# Altium schematic sheet ESP_Grow_Main_V2_1_CPU.SchDoc: CPU
size A; DocumentNumber: 3/7/2021; Revision: A; SheetNumber: 5; SheetTotal: 1
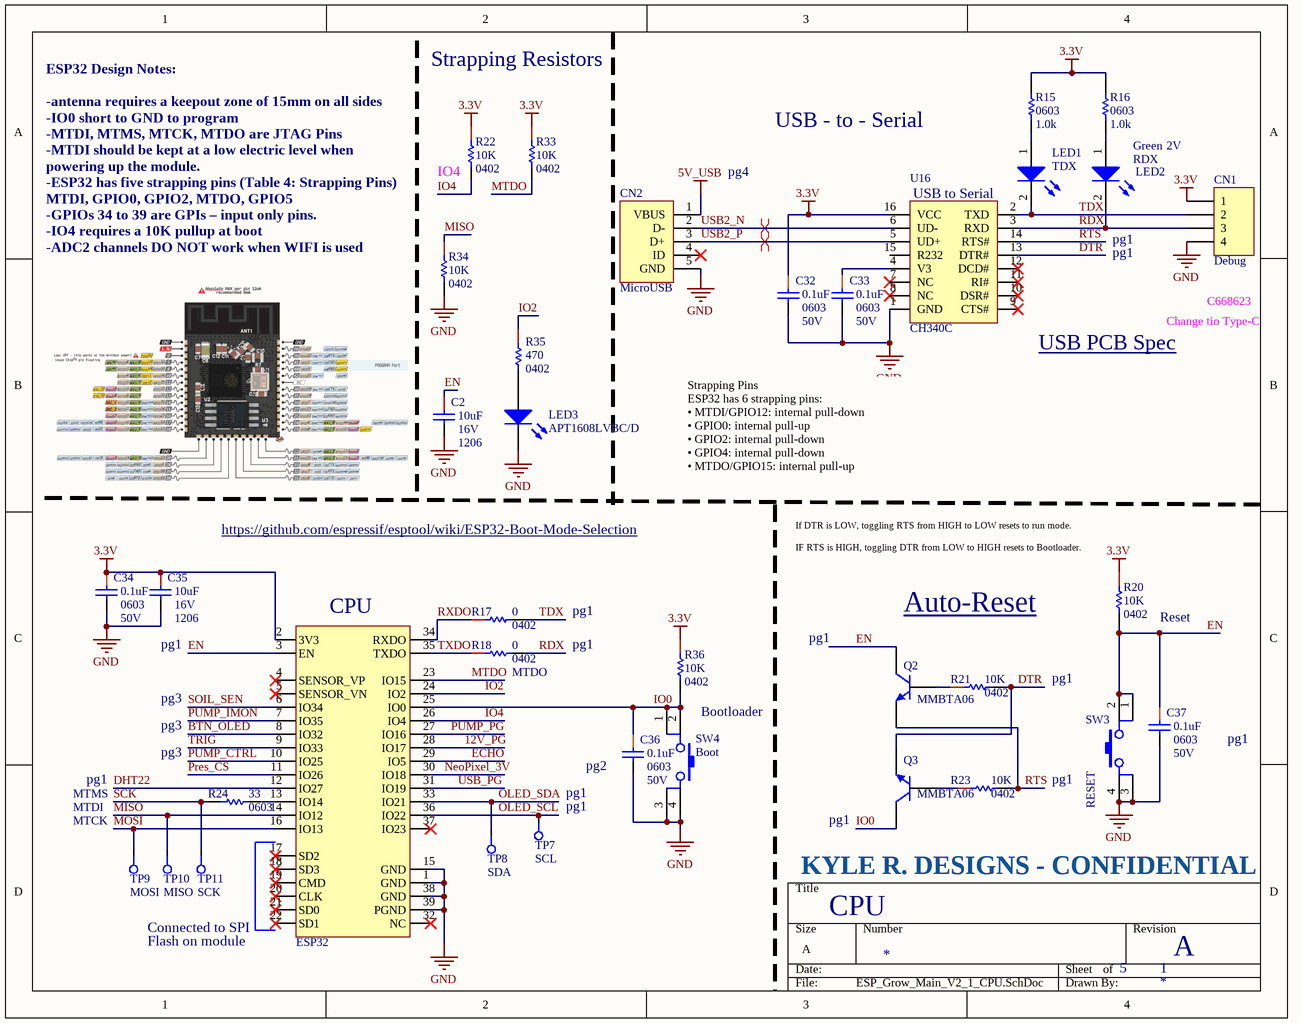
[diagram p0: ESP_Grow_Main_V2_1_CPU.SchDoc]

## Parts
C2  10uF  Voltage - Rated: 16V  Package: 1206  [CAPC1206(3216)_M]
C32  Package / Case: 0603  Voltage - Rated: 50V  [CAPC0603(1608)_L]  (hidden comment: 0.1uF)
C33  Package / Case: 0603  Voltage - Rated: 50V  [CAPC0603(1608)_L]  (hidden comment: 0.1uF)
C34  Package / Case: 0603  Voltage - Rated: 50V  [CAPC0603(1608)_L]  (hidden comment: 0.1uF)
C35  10uF  Voltage - Rated: 16V  Package: 1206  [CAPC1206(3216)_M]
C36  Package / Case: 0603  Voltage - Rated: 50V  [CAPC0603(1608)_L]  (hidden comment: 0.1uF)
C37  Package / Case: 0603  Voltage - Rated: 50V  [CAPC0603(1608)_L]  (hidden comment: 0.1uF)
CN1  Debug  [HDR1X4]
CN2  MicroUSB  [10118194-0001LF]
LED1  TDX  [SM-LED-0603]
LED2  RDX  Color: Green  Voltage - Forward (Vf) (Typ): 2V  [SM-LED-0603]
LED3  APT1608LVBC/D  [SM-LED-0603]
Q2  MMBTA06  [SOT23]
Q3  MMBTA06  [SOT23]
R15  Package / Case: 0603  [RESC0603(1608)_N]  (hidden comment: 1.0K)
R16  Package / Case: 0603  [RESC0603(1608)_N]  (hidden comment: 1.0K)
R17  Package (Imperial): 0402  Resistance: 0  [RESC0402(1005)_M]  (hidden comment: 0.0)
R18  Package (Imperial): 0402  Resistance: 0  [RESC0402(1005)_M]  (hidden comment: 0.0)
R20  Resistance: 10K  Package: 0402  [RESC0402(1005)_N]  (hidden comment: 0402WGF1002TCE)
R21  Resistance: 10K  Package: 0402  [RESC0402(1005)_N]  (hidden comment: 0402WGF1002TCE)
R22  Resistance: 10K  Package: 0402  [RESC0402(1005)_N]  (hidden comment: 0402WGF1002TCE)
R23  Resistance: 10K  Package: 0402  [RESC0402(1005)_N]  (hidden comment: 0402WGF1002TCE)
R24  Package / Case: 0603  [RESC0603(1608)_L]  (hidden comment: 33)
R33  Resistance: 10K  Package: 0402  [RESC0402(1005)_N]  (hidden comment: 0402WGF1002TCE)
R34  Resistance: 10K  Package: 0402  [RESC0402(1005)_N]  (hidden comment: 0402WGF1002TCE)
R35  Package (Imperial): 0402  [RESC0402(1005)_M]  (hidden comment: 470)
R36  Resistance: 10K  Package: 0402  [RESC0402(1005)_N]  (hidden comment: 0402WGF1002TCE)
SW3  RESET  [SW TACT Red 6mm x 6mm]
SW4  Boot  [SW TACT Red 6mm x 6mm]
TP7  SCL  [Pogo-Testpoint]  (no BOM)
TP8  SDA  [Pogo-Testpoint]  (no BOM)
TP9  MOSI  [Pogo-Testpoint]  (no BOM)
TP10  MISO  [Pogo-Testpoint]  (no BOM)
TP11  SCK  [Pogo-Testpoint]  (no BOM)
U16  CH340C  [SOP-16]
U17  ESP32  [ESP32]

## Nets
3.3V: C32.1 C34.1 C35.1 CN1.1 R15.2 R16.2 R20.1 R22.1 R33.1 R36.1 U16.16(VCC) U17.2(3V3)
5V_USB: CN2.1(VBUS)
GND: C2.2 C32.2 C33.2 C34.2 C35.2 C36.2 C37.2 CN1.4 CN2.5(GND) LED3.2(Cathode) R34.2 SW3.3 SW3.4 SW4.3 SW4.4 U16.1(GND) U17.1(GND) U17.15(GND) U17.38(GND) U17.39(PGND)
12V_PG: U17.28(IO17)
BTN_OLED: U17.8(IO32)
DHT22: U17.12(IO27)
DTR: Q3.2(E) R21.2 U16.13(DTR#)
ECHO: U17.29(IO5)
EN: C2.1 C37.1 Q2.3(C) R20.2 SW3.1 SW3.2 U17.3(EN)
IO0: C36.1 Q3.3(C) R36.2 SW4.1 SW4.2 U17.25(IO0)
IO2: R35.1 U17.24(IO2)
IO4: R22.2 U17.26(IO4)
MISO: R34.1 TP10.1 U17.14(IO12)
MOSI: TP9.1 U17.16(IO13)
MTDO: R33.2 U17.23(IO15)
NeoPixel_3V: U17.30(IO18)
OLED_SCL: TP7.1 U17.36(IO22)
OLED_SDA: TP8.1 U17.33(IO21)
Pres_CS: U17.11(IO26)
PUMP_CTRL: U17.10(IO25)
PUMP_IMON: U17.7(IO35)
PUMP_PG: U17.27(IO16)
RDX: CN1.3 LED2.2(K) R18.2 U16.3(RXD)
RTS: Q2.2(E) R23.2 U16.14(RTS#)
RXDO: R17.1 U17.34(RXDO)
SCK: R24.2 TP11.1
SOIL_SEN: U17.6(IO34)
TDX: CN1.2 LED1.2(K) R17.2 U16.2(TXD)
TRIG: U17.9(IO33)
TXDO: R18.1 U17.35(TXDO)
USB2_N: CN2.2(D-) U16.6(UD-)
USB2_P: CN2.3(D+) U16.5(UD+)
USB_PG: U17.31(IO19)
NetC33_1: C33.1 U16.4(V3)
NetLED1_1: LED1.1(A) R15.1
NetLED2_1: LED2.1(A) R16.1
NetLED3_1: LED3.1(Anode) R35.2
NetQ2_1: Q2.1(B) R21.1
NetQ3_1: Q3.1(B) R23.1
NetR24_1: R24.1 U17.13(IO14)

Not connected (* = marked no-connect by the designer): CN2 4(ID)*; U16 7(NC)* 8(NC)* 9(CTS#)* 10(DSR#)* 11(RI#)* 12(DCD#)* 15(R232); U17 4(SENSOR_VP)* 5(SENSOR_VN)* 17(SD2)* 18(SD3)* 19(CMD)* 20(CLK)* 21(SD0)* 22(SD1)* 32(NC)* 37(IO23)*

## Layout directives
differential pair: USB2_N, USB2_P

## Notes on the sheet
- Strapping Resistors
- USB - to - Serial
- (near R22) IO4
- pg4
- pg1
- (near U16) USB PCB Spec <https://www.ftdichip.com/Support/Documents/AppNotes/AN_146_USB_Hardware_Design_Guidelines_for_FTDI_ICs.pdf>
- Change tio Type-C
- C668623
- ESP32 Design Notes:
  -antenna requires a keepout zone of 15mm on all sides
  -IO0 short to GND to program
  -MTDI, MTMS, MTCK, MTDO are JTAG Pins
  -MTDI should be kept at a low electric level when powering up the module.
  -ESP32 has five strapping pins (Table 4: Strapping Pins) MTDI, GPIO0, GPIO2, MTDO, GPIO5
  -GPIOs 34 to 39 are GPIs – input only pins.
  -IO4 requires a 10K pullup at boot
  -ADC2 channels DO NOT work when WIFI is used
- Strapping Pins
  ESP32 has 6 strapping pins:
  • MTDI/GPIO12: internal pull-down
  • GPIO0: internal pull-up
  • GPIO2: internal pull-down
  • GPIO4: internal pull-down
  • MTDO/GPIO15: internal pull-up
  • GPIO5: internal pull-up
- https://github.com/espressif/esptool/wiki/ESP32-Boot-Mode-Selection
- (near R20) If DTR is LOW, toggling RTS from HIGH to LOW resets to run mode.
  IF RTS is HIGH, toggling DTR from LOW to HIGH resets to Bootloader.
- (near U17) CPU
- Auto-Reset <https://cdn.sparkfun.com/assets/learn_tutorials/5/0/7/esp32-thing-schematic.pdf>
- (near R20) Reset
- (near C35) pg1
- pg3
- (near R18) MTDO
- (near C36) pg2
- Bootloader
- MTMS
- MTDI
- (near TP9) MTCK
- (near TP7) pg1
- (near Q3) pg1
- KYLE R. DESIGNS - CONFIDENTIAL
- (near U17) Flash on module
- (near U17) Connected to SPI
- (in symbol CH340C) USB to Serial

## Library data of the parts
C2 C35 = CAP CER 10UF 16V 1206: Temperature Coefficient: X7R; LCSC: C126600; Capacitance: 10uF; Supplier 1: Digi-Key; Supplier Part Number 1: 490-4793-1-ND
C32-C34 C36 C37 = 0.1uF_0603: 100NF 50V 0603; Manufacturer: YAGEO; Manufacturer Part Number: CC0603KRX7R9BB104; Tolerance: ±10%; Temperature Coefficient: X7R; Supplier 1: Digi-Key; RoHS: RoHS Compliant; Category: Capacitors; Stock 1: 2360000; Pricing 1: 4000=0.00414, 8000=0.00378, 12000=0.0036, 28000=0.00342, 100000=0.00248 (USD); Packaging: Tape & Reel (TR); Mounting Type: Surface Mount, MLCC; Operating Temperature: -55°C ~ 125°C; Applications: General Purpose; Ratings: -; Size / Dimension: 0.063" L x 0.031" W (1.60mm x 0.80mm); Height - Seated (Max): -; Thickness (Max): 0.034" (0.87mm); Lead Spacing: -; Features: -; Lead Style: -; ComponentLink1URL: http://www.kemet.com/datasheets&C0603C104K4RACTU; ComponentLink1Description: http://www.kemet.com/datasheets&C0603C104K4RACTU; Supplier Part Number 1: 399-1096-2-ND; ComponentLink2Description: New link; ComponentLink2URL: *; LCSC Part #: C14663; Capacitance: 0.1uF
CN1 = Header 4: Header, 4-Pin; Manufacturer: Sullins Connector Solutions; Manufacturer Part Number: PRPC004SAAN-RC; Connector Type: Header, Unshrouded, Breakaway; Number of Positions: 4; Number of Positions Loaded: All; Pitch: 0.100" (2.54mm); Supplier 1: Digi-Key; RoHS: RoHS Compliant; Category: Connectors, Interconnects; Stock 1: 0; Pricing 1: 1=0.2, 10=0.175, 100=0.1443, 500=0.1141, 1000=0.09794, 5000=0.08935, 10000=0.08591 (USD); Packaging: Bulk; Contact Type: Male Pin; Number of Rows: 1; Row Spacing: -; Contact Mating Length: 0.230" (5.84mm); Mounting Type: Through Hole; Termination: Solder; Fastening Type: -; Features: -; Contact Finish: Gold; Contact Finish Thickness: Flash; Color: Black; ComponentLink1URL: http://media.digikey.com/PDF/Data%20Sheets/Sullins%20PDFs/xRxCzzzSxxN-RC_ST_11635-B.pdf; ComponentLink1Description: http://media.digikey.com/PDF/Data%20Sheets/Sullins%20PDFs/xRxCzzzSxxN-RC_ST_11635-B.pdf; Supplier Part Number 1: S1011EC-04-ND
CN2 = 10118194-0001LF: Amphenol FCI CONN USB MICRO B RECPT SMT R/A; Connector Type: USB - micro B; Number of Contacts: 5; Gender: Receptacle; Specifications: USB 2.0; Number of Ports: 1; Current Rating: 1.8A per Contact; Voltage - Rated: 100VAC; Mating Cycles: 10000; Shielding: Shielded; Material Flammability Rating: UL94 V-0; ClassName: *; Supplier 1: Digi-Key; Manufacturer: Amphenol FCI; Manufacturer Part Number: 10118194-0001LF; RoHS: RoHS Compliant; Category: Connectors, Interconnects; Stock 1: 220681; Pricing 1: 1=0.46, 10=0.437, 25=0.3744, 50=0.318, 100=0.3056, 250=0.27444, 500=0.26196 (USD); Packaging: Cut Tape (CT); Part Status: Active; Mounting Type: Surface Mount, Right Angle; Through Hole; Mounting Feature: Horizontal; Termination: Solder; Features: Solder Retention; Ingress Protection: -; Operating Temperature: -30°C ~ 80°C; Contact Finish: Gold; Shell/Shielding Material: Steel, Stainless; Insulation Color: Black; ComponentLink1URL: http://portal.fciconnect.com/Comergent//fci/drawing/10118194.pdf; ComponentLink1Description: http://portal.fciconnect.com/Comergent//fci/drawing/10118194.pdf; Supplier Part Number 1: 609-4618-1-ND
LED1 = CMP-001-0086-06: LED GREEN CLEAR THIN 0603 SMD; Manufacturer Part Number: LTST-C191KGKT; Manufacturer: Lite-On Inc; Millicandela Rating: 35mcd; Wavelength - Peak: 574nm; Current - Test: 20mA; Wavelength - Dominant: 571nm; Viewing Angle: 130°; Lens Style/Size: Rectangle with Flat Top, 1.1mm x 0.8mm; Voltage - Forward (Vf) (Typ): 2V; Color: Green; Size / Dimension: 1.60mm L x 0.80mm W; Mounting Type: Surface Mount; Designator: LTST-C191KGKT; Height: 0.55mm; RoHS: RoHS Compliant; Package / Case: 0603 (1608 Metric); Packaging: Cut Tape (CT); Lens Type: Clear; Pin Count: 2; Stock 1: 84829; Pricing 1: 1=0.3, 10=0.238, 100=0.1296, 250=0.0864, 500=0.07344, 1000=0.05616, 2500=0.05076 (USD); ClassName: *
LED2 = CMP-001-0086-06: LED GREEN CLEAR THIN 0603 SMD; Manufacturer Part Number: LTST-C191KGKT; Manufacturer: Lite-On Inc; Millicandela Rating: 35mcd; Wavelength - Peak: 574nm; Current - Test: 20mA; Wavelength - Dominant: 571nm; Viewing Angle: 130°; Lens Style/Size: Rectangle with Flat Top, 1.1mm x 0.8mm; Size / Dimension: 1.60mm L x 0.80mm W; Mounting Type: Surface Mount; Designator: LTST-C191KGKT; Height: 0.55mm; RoHS: RoHS Compliant; Package / Case: 0603 (1608 Metric); Packaging: Cut Tape (CT); Lens Type: Clear; Pin Count: 2; Stock 1: 84829; Pricing 1: 1=0.3, 10=0.238, 100=0.1296, 250=0.0864, 500=0.07344, 1000=0.05616, 2500=0.05076 (USD); ClassName: *
LED3 = CMP-001-0901-02: LED BLUE CLEAR 2SMD 2.65V; Luminous Intensity: 24mcd; Test Current: 2mA; Dominant Wavelength: 470nm; Viewing Angle: 120°; Lens Color: Colorless; Case Code (Metric): 1608; Length: 1.6mm; Forward Voltage: 2.65V; Width: 0.8mm; Height: 0.75mm; Packaging: Tape and Reel; Case/Package: 0603; Mount: Surface Mount; Color: Blue; Lens Transparency: Clear; Case Code (Imperial): 0603
Q2 Q3 = MMBTA06: TRANS NPN 80V 0.5A SOT-23; Manufacturer: ON Semiconductor; Manufacturer Part Number: MMBTA06LT3G; Vce Saturation (Max) @ Ib, Ic: 250mV @ 10mA, 100mA; Current - Collector Cutoff (Max): 100nA; DC Current Gain (hFE) (Min) @ Ic, Vce: 100 @ 100mA, 1V; Frequency - Transition: 100MHz; Supplier 1: Digi-Key; RoHS: RoHS Compliant; Category: Discrete Semiconductor Products; Stock 1: 16604; Pricing 1: 1=0.21, 10=0.196, 100=0.1067, 500=0.06566, 1000=0.04476 (USD); Packaging: Cut Tape (CT); Part Status: Active; Transistor Type: NPN; Operating Temperature: -55°C ~ 150°C (TJ); Mounting Type: Surface Mount; Package / Case: TO-236-3, SC-59, SOT-23-3; Supplier Device Package: SOT-23-3 (TO-236); Base Part Number: MMBTA06; ComponentLink1URL: http://www.onsemi.com/pub/Collateral/MMBTA05LT1-D.PDF; ComponentLink1Description: http://www.onsemi.com/pub/Collateral/MMBTA05LT1-D.PDF; Supplier Part Number 1: MMBTA06LT3GOSCT-ND
R15 R16 = RES 1K OHM 1% 1/10W 0603: 1.0K 0603; Manufacturer: Stackpole Electronics Inc.; Manufacturer Part Number: RMCF0603FT1K00; Tolerance: ±1%; Power (Watts): 0.1W, 1/10W; Temperature Coefficient: ±100ppm/°C; Supplier 1: Digi-Key; RoHS: RoHS Compliant; Category: Resistors; Stock 1: 411308; Pricing 1: 1=0.1, 10=0.02, 100=0.0081, 1000=0.00364, 2500=0.00316 (USD); Packaging: Cut Tape (CT); Part Status: Active; Composition: Thick Film; Features: Automotive AEC-Q200; Operating Temperature: -55°C ~ 155°C; Size / Dimension: 0.061" L x 0.031" W (1.55mm x 0.80mm); Height - Seated (Max): 0.022" (0.55mm); Failure Rate: -; ComponentLink1URL: https://www.seielect.com/Catalog/SEI-RMCF_RMCP.pdf; ComponentLink1Description: https://www.seielect.com/Catalog/SEI-RMCF_RMCP.pdf; Supplier Part Number 1: RMCF0603FT1K00CT-ND; Supplier Device Package: 0603; Resistance (Ohms): 1.0k
R17 R18 = CMP-007-0303-14: RES 0.0 OHM JUMPER 1/10W 0402; Power: 63mW; Package (Metric): 1005; Tolerance: 0%; Operating Temperature: -55°C ~ 155°C; Length: 1mm; Temperature Coefficient: -; Height: 400µm; Termination: SMD/SMT
R20-R23 R33 R34 R36 = 10k_0402: 10KOHMS ±1% 1/10W 0402; Supplier Part Number 1: C25744; Manufacturer Part Number 1: 0402WGF1002TCE; Supplier 1: LCSC
R24 = RES 33 OHM 1/10W 5% 0603 SMD: 33 0603; Manufacturer: Panasonic Electronic Components; Manufacturer Part Number: ERJ-3GEYJ330V; Tolerance: ±5%; Power (Watts): 0.1W, 1/10W; Temperature Coefficient: ±200ppm/°C; Supplier 1: Digi-Key; RoHS: RoHS Compliant; Category: Resistors; Stock 1: 499360; Pricing 1: 1=0.1, 50=0.0126, 100=0.0096, 250=0.00716, 500=0.00528, 1000=0.00352, 2500=0.00297 (USD); Packaging: Cut Tape (CT); Resistance (Ohms): 33; Composition: Thick Film; Features: -; Supplier Device Package: 0603; Size / Dimension: 0.063" L x 0.031" W (1.60mm x 0.80mm); Height: 0.022" (0.55mm); Number of Terminations: 2; ComponentLink1URL: http://industrial.panasonic.com/www-cgi/jvcr13pz.cgi?E+PZ+3+AOA0001+ERJ3GEYJ330V+7+WW; ComponentLink1Description: http://industrial.panasonic.com/www-cgi/jvcr13pz.cgi?E+PZ+3+AOA0001+ERJ3GEYJ330V+7+WW; Supplier Part Number 1: P33GCT-ND
R35 = CMP-007-0512-12: RES 470 OHM 1% 1/10W 0402; Temperature Coefficient: ±100ppm/°C; Power: 63mW; Package (Metric): 1005; Operating Temperature: -55°C ~ 155°C; Height: 400µm; Length: 1mm; Termination: SMD/SMT; Tolerance: 1%; Resistance: 470
SW3 SW4 = PTS645SM43SMTR92 LFS: SWITCH TACTILE SPST-NO 0.05A 12V; Manufacturer: C&K; Switch Function: Off-Mom; Contact Rating @ Voltage: 0.05A @ 12VDC; Actuator Type: Standard; Actuator Height off PCB, Vertical: 4.30mm; Actuator Orientation: Top Actuated; Outline: 6.00mm x 6.00mm; Illumination: Non-Illuminated; Operating Force: 160gf; Actuator Material: Polyamide (PA66), Nylon 6/6; Mechanical Life: 100,000 Cycles; ClassName: *; Supplier 1: Digi-Key; Manufacturer Part Number: PTS645SM43SMTR92 LFS; RoHS: RoHS Compliant; Category: Switches; Stock 1: 234699; Pricing 1: 1=0.15, 10=0.147, 25=0.1416, 50=0.1366, 100=0.129, 250=0.12144, 500=0.11638 (USD); Packaging: Cut Tape (CT); Part Status: Active; Circuit: SPST-NO; Mounting Type: Surface Mount; Actuator Length, Right Angle: -; Termination Style: Gull Wing; Illumination Type, Color: -; Illumination Voltage (Nominal): -; Ingress Protection: -; Features: Blue Actuator; Switch Travel: -; Operating Temperature: -20°C ~ 60°C; ComponentLink1URL: http://www.ckswitches.com/media/1471/pts645.pdf; ComponentLink1Description: http://www.ckswitches.com/media/1471/pts645.pdf; Supplier Part Number 1: CKN9112CT-ND
TP7-TP11 = CMP-001-0557-03: Test Point- Current one; Pin Count: 1; Component Name: TestPoint; Designator: TestPoint
U16 = CH340C: USB to Serial UART; ComponentLink2URL: https://lcsc.com/product-detail/USB_CH340C_C84681.html; ComponentLink1URL: https://www.sparkfun.com/products/15096; ComponentLink2Description: LCSC Part Link; ComponentLink1Description: Sparkfun Demo Board
U17 = U/ESP32-WROOM-32D: ESP32 module